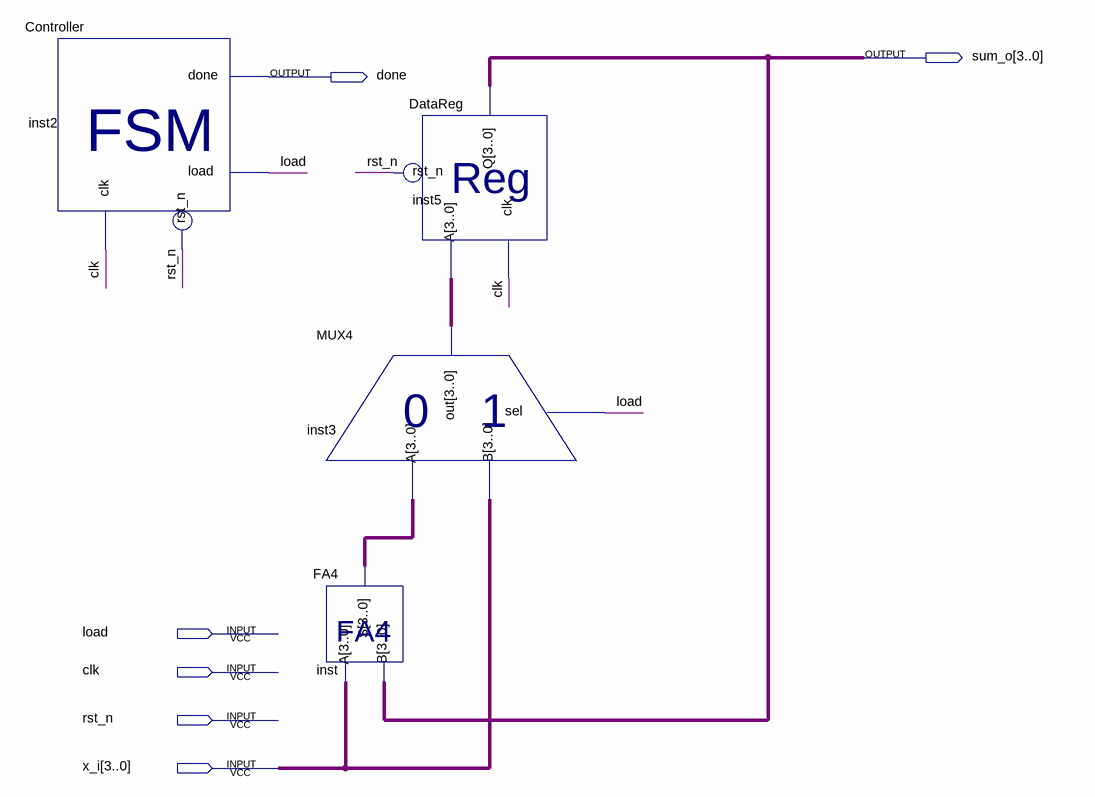
[diagram p0: schematic sheet]
// Quartus schematic AC4.bdf as structural Verilog: 4 symbols, 6 pins
module AC4 (
  input  load,
  input  clk,
  input  rst_n,
  input  [3:0] x_i,
  output [3:0] sum_o,
  output done
);

  wire [3:0] inst3_out, inst_s;

  Controller inst2 (.rst_n(rst_n), .clk(clk), .load(load), .done(done));
  MUX4 inst3 (.A(inst_s), .B(x_i), .sel(load), .out(inst3_out));
  FA4 inst (.A(x_i), .B(sum_o), .S(inst_s));
  DataReg inst5 (.A(inst3_out), .clk(clk), .rst_n(rst_n), .Q(sum_o));
endmodule
